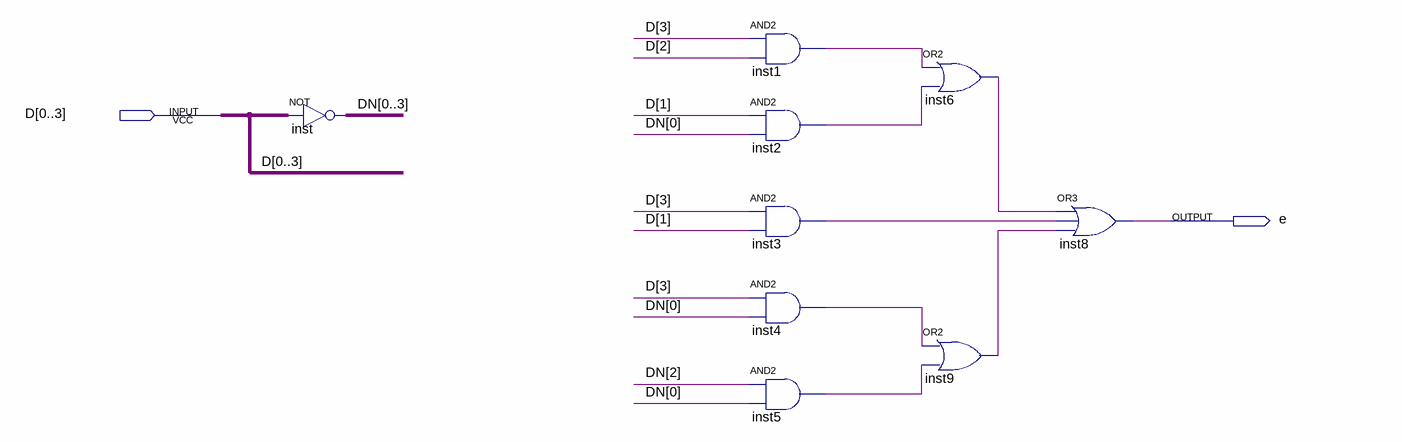
[diagram p0: schematic sheet]
// Quartus schematic d4.bdf as structural Verilog: 9 symbols, 2 pins
module d4 (
  input  [0:3] D,
  output e
);

  wire inst1_out, inst2_out, inst3_out, inst4_out, inst5_out, inst6_out, inst9_out;
  wire [3:0] DN;

  assign {DN[0], DN[1], DN[2], DN[3]} = ~D;  // NOT inst, 4 bits wide
  and inst1 (inst1_out, D[3], D[2]);
  and inst2 (inst2_out, D[1], DN[0]);
  and inst3 (inst3_out, D[3], D[1]);
  and inst4 (inst4_out, D[3], DN[0]);
  and inst5 (inst5_out, DN[2], DN[0]);
  or inst6 (inst6_out, inst1_out, inst2_out);
  or inst9 (inst9_out, inst4_out, inst5_out);
  or inst8 (e, inst6_out, inst3_out, inst9_out);
endmodule
